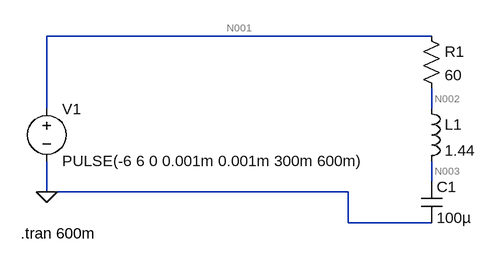
[diagram p0: schematic Draft4.asc]
Draft4.asc, the LTspice schematic file:
Version 4.1
SHEET 1 880 680
WIRE 656 -64 64 -64
WIRE 64 48 64 -64
WIRE 656 48 656 16
WIRE 656 160 656 128
WIRE 64 176 64 128
WIRE 528 176 64 176
WIRE 528 224 528 176
WIRE 656 224 528 224
FLAG 64 176 0
SYMBOL voltage 64 32 R0
WINDOW 123 0 0 Left 0
WINDOW 39 0 0 Left 0
SYMATTR InstName V1
SYMATTR Value PULSE(-6 6 0 0.001m 0.001m 300m 600m)
SYMBOL res 640 -80 R0
SYMATTR InstName R1
SYMATTR Value 60
SYMBOL ind 640 32 R0
SYMATTR InstName L1
SYMATTR Value 1.44
SYMATTR SpiceLine Rser=0
SYMBOL cap 640 160 R0
SYMATTR InstName C1
SYMATTR Value 100µ
TEXT 24 240 Left 2 !.tran 600m

The netlist it stands for:
* Draft4.asc
V1 N001 0 PULSE(-6 6 0 0.001m 0.001m 300m 600m)
R1 N001 N002 60
L1 N002 N003 1.44 Rser=0
C1 N003 0 100µ
.tran 600m
.backanno
.end

* Results of the author's LTspice run, read from the files saved beside the schematic
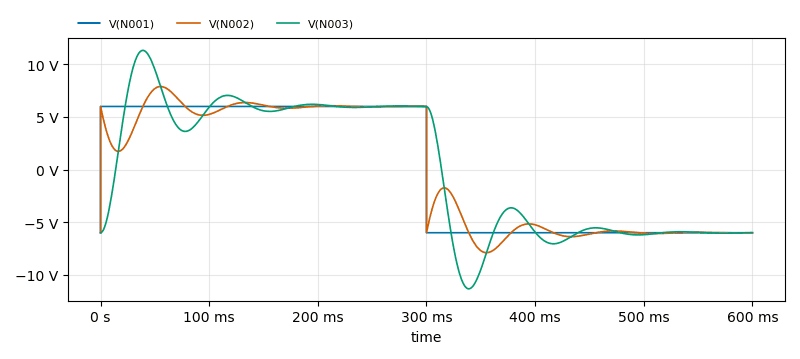
[diagram p1: Transient Analysis of Draft4.asc, plotted from the saved traces]
* Transient Analysis, 1 run:
*   V(N001): min -6 V, max 6 V, average 20 µV, rms 6 V, last -6 V
*   V(N002): min -7.896 V, max 7.896 V, average -67.73 µV, rms 5.879 V, last -6.01 V
*   V(N003): min -11.33 V, max 11.33 V, average -478.3 µV, rms 6.35 V, last -5.991 V